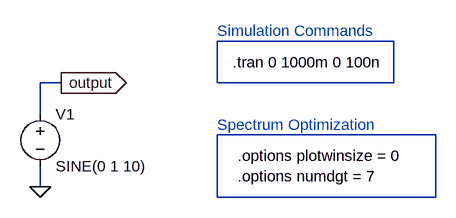
[diagram p0: schematic reference_circuit.asc]
reference_circuit.asc, the LTspice schematic file:
Version 4
SHEET 1 880 680
WIRE 592 0 320 0
WIRE 80 64 48 64
WIRE 320 64 320 0
WIRE 592 64 592 0
WIRE 592 64 320 64
WIRE 48 112 48 64
WIRE 656 144 320 144
WIRE 48 224 48 192
WIRE 320 240 320 144
WIRE 656 240 656 144
WIRE 656 240 320 240
FLAG 48 224 0
FLAG 80 64 output
IOPIN 80 64 Out
SYMBOL voltage 48 96 R0
WINDOW 123 0 0 Left 0
WINDOW 39 0 0 Left 0
SYMATTR InstName V1
SYMATTR Value SINE(0 1 10)
TEXT 352 176 Left 2 !.options plotwinsize = 0\n.options numdgt = 7
TEXT 320 128 Left 2 ;Spectrum Optimization
TEXT 344 32 Left 2 !.tran 0 1000m 0 100n
TEXT 320 -16 Left 2 ;Simulation Commands

The netlist it stands for:
* reference_circuit.asc
V1 output 0 SINE(0 1 10)
.options plotwinsize = 0
.options numdgt = 7
* Spectrum Optimization
.tran 0 1000m 0 100n
* Simulation Commands
.backanno
.end